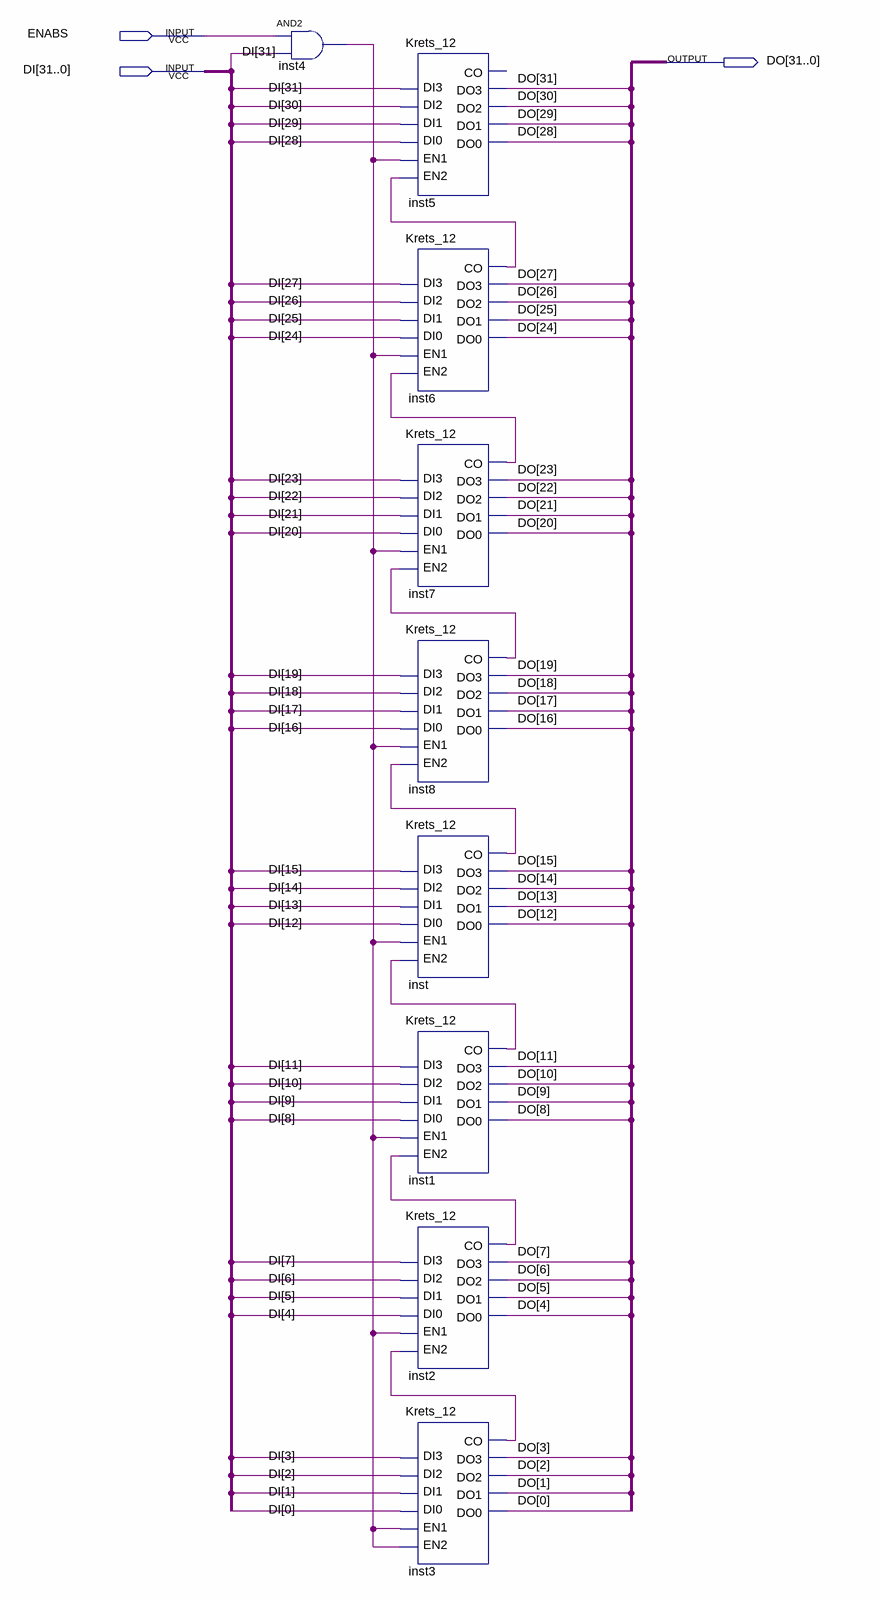
[diagram p0: schematic sheet]
// Quartus schematic ABS.bdf as structural Verilog: 9 symbols, 3 pins
module ABS (
  input  ENABS,
  input  [31:0] DI,
  output [31:0] DO
);

  wire inst1_co, inst2_co, inst3_co, inst4_out, inst6_co, inst7_co, inst8_co, inst_co;

  and inst4 (inst4_out, ENABS, DI[31]);
  Krets_12 inst5 (
    .DI3(DI[31]), .DI2(DI[30]), .DI1(DI[29]), .DI0(DI[28]), .EN2(inst6_co), .EN1(inst4_out), .DO3(DO[31]),
    .DO2(DO[30]), .DO1(DO[29]), .DO0(DO[28]));  // open: CO
  Krets_12 inst6 (
    .DI3(DI[27]), .DI2(DI[26]), .DI1(DI[25]), .DI0(DI[24]), .EN2(inst7_co), .EN1(inst4_out), .CO(inst6_co),
    .DO3(DO[27]), .DO2(DO[26]), .DO1(DO[25]), .DO0(DO[24]));
  Krets_12 inst7 (
    .DI3(DI[23]), .DI2(DI[22]), .DI1(DI[21]), .DI0(DI[20]), .EN2(inst8_co), .EN1(inst4_out), .CO(inst7_co),
    .DO3(DO[23]), .DO2(DO[22]), .DO1(DO[21]), .DO0(DO[20]));
  Krets_12 inst8 (
    .DI3(DI[19]), .DI2(DI[18]), .DI1(DI[17]), .DI0(DI[16]), .EN2(inst_co), .EN1(inst4_out), .CO(inst8_co),
    .DO3(DO[19]), .DO2(DO[18]), .DO1(DO[17]), .DO0(DO[16]));
  Krets_12 inst (
    .DI3(DI[15]), .DI2(DI[14]), .DI1(DI[13]), .DI0(DI[12]), .EN2(inst1_co), .EN1(inst4_out), .CO(inst_co),
    .DO3(DO[15]), .DO2(DO[14]), .DO1(DO[13]), .DO0(DO[12]));
  Krets_12 inst1 (
    .DI3(DI[11]), .DI2(DI[10]), .DI1(DI[9]), .DI0(DI[8]), .EN2(inst2_co), .EN1(inst4_out), .CO(inst1_co),
    .DO3(DO[11]), .DO2(DO[10]), .DO1(DO[9]), .DO0(DO[8]));
  Krets_12 inst2 (
    .DI3(DI[7]), .DI2(DI[6]), .DI1(DI[5]), .DI0(DI[4]), .EN2(inst3_co), .EN1(inst4_out), .CO(inst2_co),
    .DO3(DO[7]), .DO2(DO[6]), .DO1(DO[5]), .DO0(DO[4]));
  Krets_12 inst3 (
    .DI3(DI[3]), .DI2(DI[2]), .DI1(DI[1]), .DI0(DI[0]), .EN2(inst4_out), .EN1(inst4_out), .CO(inst3_co),
    .DO3(DO[3]), .DO2(DO[2]), .DO1(DO[1]), .DO0(DO[0]));
endmodule
